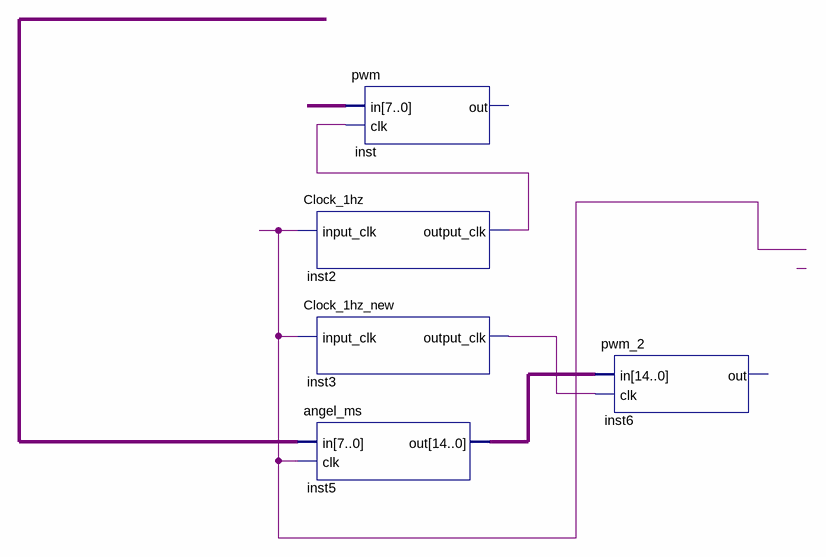
[diagram p0: schematic sheet]
// Quartus schematic Shpere_top.bdf as structural Verilog: 5 symbols, 0 pins
module Shpere_top (
);

  wire inst2_output_clk, inst3_output_clk, undriven_2;
  wire [7:0] undriven, undriven_3;
  wire [14:0] inst5_out;

  Clock_1hz inst2 (.input_clk(undriven_2), .output_clk(inst2_output_clk));
  Clock_1hz_new inst3 (.input_clk(undriven_2), .output_clk(inst3_output_clk));
  angel_ms inst5 (.in(undriven), .clk(undriven_2), .out(inst5_out));
  pwm inst (.in(undriven_3), .clk(inst2_output_clk));  // open: out
  pwm_2 inst6 (.in(inst5_out), .clk(inst3_output_clk));  // open: out
endmodule
